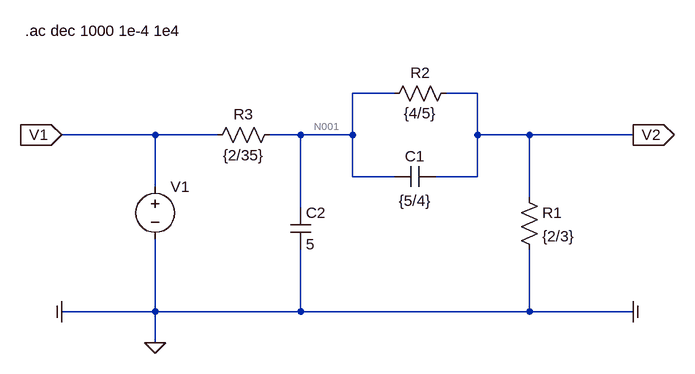
[diagram p0: schematic TS12_Ejercicio_2_LTSpice_Y22.asc]
TS12_Ejercicio_2_LTSpice_Y22.asc, the LTspice schematic file:
Version 4
SHEET 1 880 768
WIRE 32 144 -32 144
WIRE 160 144 112 144
WIRE -336 208 -480 208
WIRE -240 208 -336 208
WIRE -112 208 -160 208
WIRE -32 208 -32 144
WIRE -32 208 -112 208
WIRE 160 208 160 144
WIRE 240 208 160 208
WIRE 400 208 240 208
WIRE -32 272 -32 208
WIRE 32 272 -32 272
WIRE 160 272 160 208
WIRE 160 272 96 272
WIRE -336 288 -336 208
WIRE 240 304 240 208
WIRE -112 320 -112 208
WIRE -336 480 -336 368
WIRE -336 480 -480 480
WIRE -112 480 -112 384
WIRE -112 480 -336 480
WIRE 240 480 240 384
WIRE 240 480 -112 480
WIRE 400 480 240 480
WIRE -336 528 -336 480
FLAG 400 208 V2
IOPIN 400 208 Out
FLAG -480 208 V1
IOPIN -480 208 In
FLAG -336 528 0
FLAG -480 480 COM
IOPIN -480 480 In
FLAG 400 480 COM
IOPIN 400 480 Out
SYMBOL voltage -336 272 R0
WINDOW 39 0 0 Left 0
SYMATTR InstName V1
SYMATTR Value ""
SYMATTR Value2 AC 1 0
SYMBOL res 224 288 R0
SYMATTR InstName R1
SYMATTR Value {2/3}
SYMBOL res 128 128 R90
WINDOW 0 0 56 VBottom 2
WINDOW 3 62 56 VBottom 2
SYMATTR InstName R2
SYMATTR Value {4/5}
SYMBOL cap 96 256 R90
WINDOW 0 0 32 VBottom 2
WINDOW 3 69 32 VBottom 2
SYMATTR InstName C1
SYMATTR Value {5/4}
SYMBOL res -144 192 R90
WINDOW 0 0 56 VBottom 2
WINDOW 3 32 56 VTop 2
SYMATTR InstName R3
SYMATTR Value {2/35}
SYMBOL cap -128 384 M180
WINDOW 0 24 56 Left 2
WINDOW 3 24 8 Left 2
SYMATTR InstName C2
SYMATTR Value 5
TEXT -536 48 Left 2 !.ac dec 1000 1e-4 1e4

The netlist it stands for:
* TS12_Ejercicio_2_LTSpice_Y22.asc
V1 V1 0 AC 1 0
R1 V2 0 {2/3}
R2 V2 N001 {4/5}
C1 V2 N001 {5/4}
R3 N001 V1 {2/35}
C2 0 N001 5
.ac dec 1000 1e-4 1e4
.backanno
.end

* Results of the author's LTspice run, read from the files saved beside the schematic
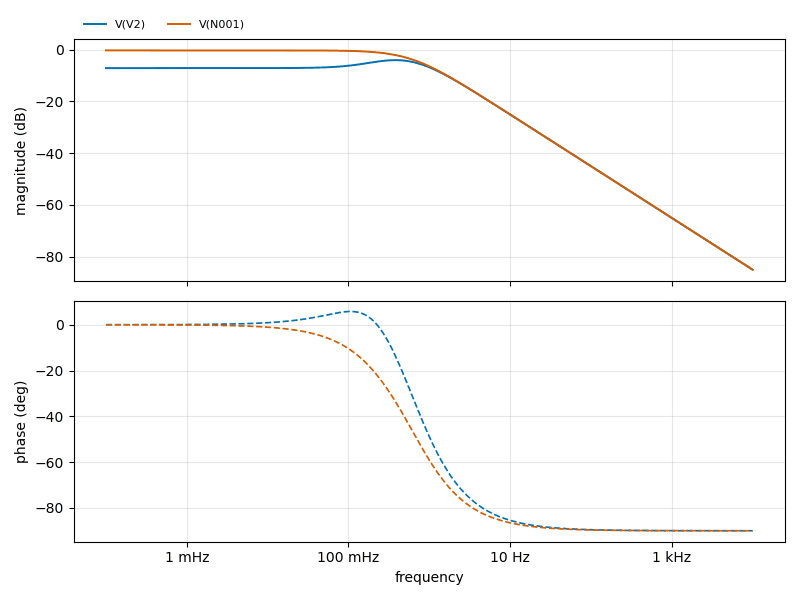
[diagram p1: AC Analysis of TS12_Ejercicio_2_LTSpice_Y22.asc, plotted from the saved traces]
* AC Analysis, 1 run:
*   V(V2): -7.18 dB at 100 µHz, -85.08 dB at 10 kHz, peak -4.09 dB at 380.2 mHz, 3 dB below the peak at 26.28 mHz and 1.041 Hz
*   V(N001): -0.33 dB at 100 µHz, -85.08 dB at 10 kHz, peak -0.33 dB at 100 µHz, 3 dB below the peak at 547.8 mHz